# Altium schematic sheet 装甲模块原理图.SchDoc
size A4
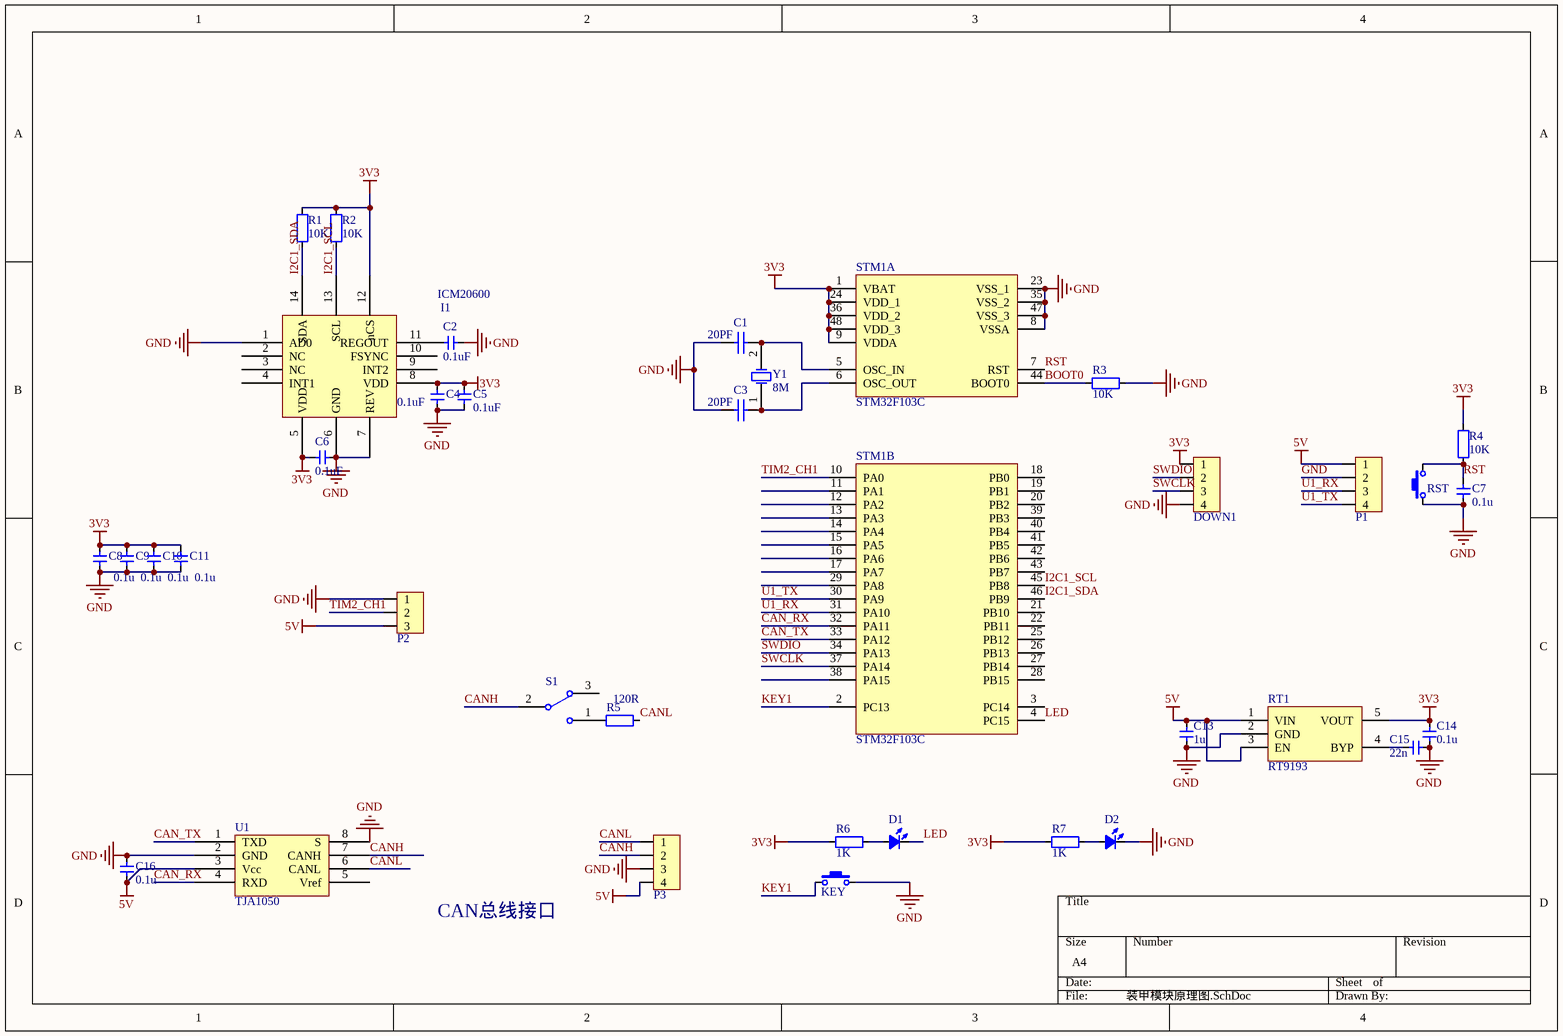
[diagram p0: 装甲模块原理图.SchDoc]

## Parts
C1  value 20PF  [CAP_0603]  (hidden comment: Cap)
C2  value 0.1uF  [CAP_0603]  (hidden comment: Cap_0603)
C3  value 20PF  [CAP_0603]  (hidden comment: Cap)
C4  value 0.1uF  [CAP_0603]  (hidden comment: Cap_0603)
C5  value 0.1uF  [CAP_0603]  (hidden comment: Cap_0603)
C6  value 0.1uF  [CAP_0603]  (hidden comment: Cap_0603)
C7  value 0.1u  [CAP_0603]  (hidden comment: Cap_0603)
C8  value 0.1u  [CAP_0603]  (hidden comment: Cap_0603)
C9  value 0.1u  [CAP_0603]  (hidden comment: Cap_0603)
C10  value 0.1u  [CAP_0603]  (hidden comment: Cap_0603)
C11  value 0.1u  [CAP_0603]  (hidden comment: Cap_0603)
C13  value 1u  [CAP_0603]  (hidden comment: Cap_0603)
C14  value 0.1u  [CAP_0603]  (hidden comment: Cap_0603)
C15  value 22n  [CAP_0603]  (hidden comment: Cap_0603)
C16  value 0.1u  [CAP_0603]  (hidden comment: Cap_0603)
D1  LED_0805  [LED_0805_RED]  (value not drawn)
D2  LED_0805  [LED_0805_RED]  (value not drawn)
DOWN1  HDR1x4_2.54  [HDR1X4_2.54_SMD]  (value not drawn)
I1  ICM20600  [ICM20600]
KEY  ButtonTACT_3x4x2_180  [ButtonTACT_3x4x2_180H]  (value not drawn)
P1  HDR1x4_2.54  [HDR1X4_2.54_SMD]  (value not drawn)
P2  HDR1x3_2.54  [XH2.54_SMT_3PIN]  (value not drawn)
P3  HDR1x4_2.54  [XH2.54_SMT_4PIN]  (value not drawn)
R1  value 10K  [RES_0603]  (hidden comment: Res_0603)
R2  value 10K  [RES_0603]  (hidden comment: Res_0603)
R3  value 10K  [RES_0603]  (hidden comment: RES_0603)
R4  value 10K  [RES_0603]  (hidden comment: RES_0603)
R5  value 120R  [RES_0603]  (hidden comment: RES_0603)
R6  value 1K  [RES_0603]  (hidden comment: RES_0603)
R7  value 1K  [RES_0603]  (hidden comment: RES_0603)
RST  ButtonTACT_3x4x2_180  [ButtonTACT_3x4x2_180H]  (value not drawn)
RT1  RT9193  [SOT23-5]
S1  SwitchSPDT_2.8x6.6_90  [SwitchSPDT_2.8X6.6_90]  (value not drawn)
STM1  STM32F103C  [LQFP_P0.5_48]  (parts A,B of 2)
U1  TJA1050  [SOP_E150_8]
Y1  8M  [Osc-6032]

## Nets
3V3: C4.1 C5.1 C6.2 C8.2 C9.2 C10.2 C11.2 C14.2 DOWN1.1 I1.5(VDD) I1.8(VDD) I1.12(nCS) R1.1 R2.1 R4.2 R6.1 R7.1 RT1.5(VOUT) STM1.1(VBAT) STM1.9(VDDA) STM1.24(VDD_1) STM1.36(VDD_2) STM1.48(VDD_3)
5V: C13.2 C16.1 P1.1 P2.3 P3.4 RT1.1(VIN) RT1.3(EN) U1.3(Vcc)
GND: C1.1 C2.2 C3.1 C4.2 C5.2 C6.1 C7.1 C8.1 C9.1 C10.1 C11.1 C13.1 C14.1 C15.1 C16.2 D2.2(K) DOWN1.4 I1.1(AD0) I1.6(GND) I1.7(REV) KEY.2 P1.2 P2.1 P3.3 R3.2 RST.1 RT1.2(GND) STM1.8(VSSA) STM1.23(VSS_1) STM1.35(VSS_2) STM1.47(VSS_3) U1.2(GND) U1.8(S)
BOOT0: R3.1 STM1.44(BOOT0)
CAN_RX: STM1.32(PA11) U1.4(RXD)
CAN_TX: STM1.33(PA12) U1.1(TXD)
CANH: P3.2 S1.2 U1.7(CANH)
CANL: P3.1 R5.2 U1.6(CANL)
I2C1_SCL: I1.13(SCL) R2.2 STM1.45(PB8)
I2C1_SDA: I1.14(SDA) R1.2 STM1.46(PB9)
KEY1: KEY.1 STM1.2(PC13)
LED: D1.2(K) STM1.4(PC15)
RST: C7.2 R4.1 RST.2 STM1.7(RST)
SWCLK: DOWN1.3 STM1.37(PA14)
SWDIO: DOWN1.2 STM1.34(PA13)
TIM2_CH1: P2.2 STM1.10(PA0)
U1_RX: P1.3 STM1.31(PA10)
U1_TX: P1.4 STM1.30(PA9)
NetC1_2: C1.2 STM1.5(OSC_IN) Y1.2(OSC2)
NetC2_1: C2.1 I1.11(REGOUT)
NetC3_2: C3.2 STM1.6(OSC_OUT) Y1.1(OSC1)
NetC15_2: C15.2 RT1.4(BYP)
NetD1_1: D1.1(A) R6.2
NetD2_1: D2.1(A) R7.2
NetR5_1: R5.1 S1.1

Not connected (* = marked no-connect by the designer): I1 2(NC) 3(NC) 4(INT1) 9(INT2) 10(FSYNC); S1 3; STM1 3(PC14) 11(PA1) 12(PA2) 13(PA3) 14(PA4) 15(PA5) 16(PA6) 17(PA7) 18(PB0) 19(PB1) 20(PB2) 21(PB10) 22(PB11) 25(PB12) 26(PB13) 27(PB14) 28(PB15) 29(PA8) 38(PA15) 39(PB3) 40(PB4) 41(PB5) 42(PB6) 43(PB7); U1 5(Vref)

## Notes on the sheet
- CAN总线接口

## Library data of the parts
C1 C3 = Cap_1: Capacitor; Published: 8-Jun-2000; LatestRevisionDate: 17-Jul-2002; LatestRevisionNote: Re-released for DXP Platform.; PackageReference: RAD-0.3; Publisher: Altium Limited
C2 C4-C11 C13-C16 = Cap_0603: Capacitor
D1 D2 = LED_0805: LED
DOWN1 P1 P3 = HDR1x4_2.54: Header
KEY RST = ButtonTACT_3x4x2_180: Button
P2 = HDR1x3_2.54: Header
R1 R2 = Res_0603: Resistor
R3-R7 = RES_0805: Resistor
RT1 = RT9193: Power
S1 = SwitchSPDT_2.8x6.6_90: Switch
STM1 = STM32F103C: MCU
Y1 = C-Osc: Crystal Oscillator; Published: 8-Jun-2000; LatestRevisionDate: 17-Jul-2002; LatestRevisionNote: Re-released for DXP Platform.; PackageReference: R38; Publisher: Altium Limited; PackageDescription: Crystal, Thru-Hole; 2 Leads; Body 3.1 x 8.2 mm (Dia.xH)